# EAGLE design untitled (EAGLE 5.11)
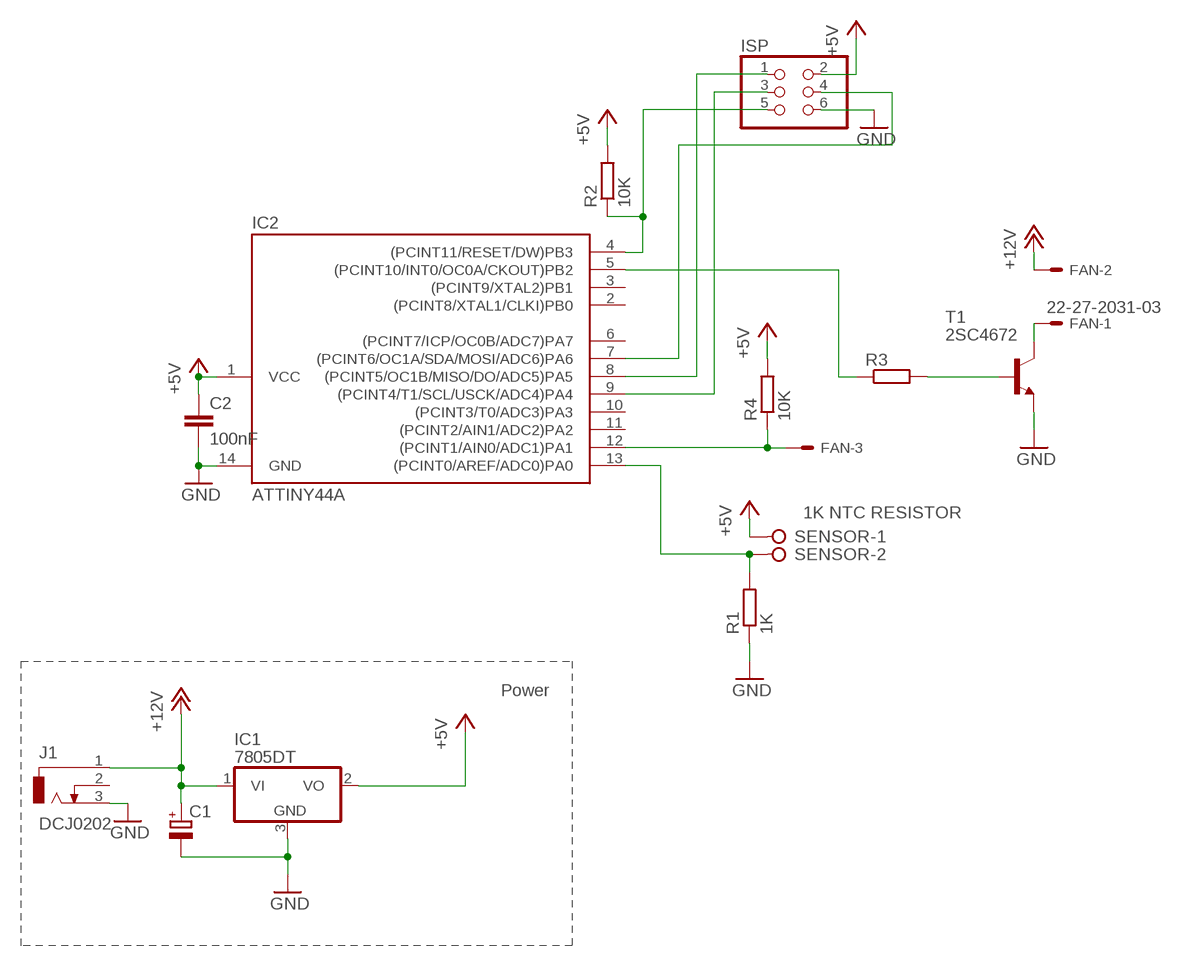
[diagram p0: schematic, sheet 1]

## Parts
C1  CPOL-EU  [NICHICON-18]
C2  100nF  C-EUC0805  [C0805]
FAN  22-27-2031-03  [6410-03]
IC1  7805DT  [TO252]
IC2  ATTINY44A  TINY24/44/84-SSU  [SOIC14]
ISP  PINHD-2X03_2.54-SMD  [2X03SMD]
J1  DCJ0202  [DCJ0202]
R1  1K  R-EU_R0805  [R0805]
R2  10K  R-EU_R0805  [R0805]
R3  R-EU_R0805  [R0805]
R4  10K  R-EU_R0805  [R0805]
SENSOR  W237-02P  [W237-132]
T1  2SC4672  -NPN-SOT89-BCE  [SOT89-BCE]

## Nets
+5V: C2.1 IC1.2(VO) IC2.1(VCC) ISP.2 R2.2 R4.2 SENSOR.1
+12V: C1.POS(+) FAN.2 IC1.1(VI) J1.1
GND: C1.NEG(-) C2.2 IC1.3(GND) IC2.14(GND) ISP.6 J1.3 R1.1 T1.E
N$1: IC2.13((PCINT0/AREF/ADC0)PA0) R1.2 SENSOR.2
N$2: IC2.4((PCINT11/RESET/DW)PB3) ISP.5 R2.1
N$3: IC2.8((PCINT5/OC1B/MISO/DO/ADC5)PA5) ISP.1
N$4: IC2.5((PCINT10/INT0/OC0A/CKOUT)PB2) R3.1
N$5: IC2.9((PCINT4/T1/SCL/USCK/ADC4)PA4) ISP.3
N$6: IC2.7((PCINT6/OC1A/SDA/MOSI/ADC6)PA6) ISP.4
N$7: R3.2 T1.B
N$8: FAN.3 IC2.12((PCINT1/AIN0/ADC1)PA1) R4.1
N$9: FAN.1 T1.C
Unconnected: IC2.2((PCINT8/XTAL1/CLKI)PB0) IC2.3((PCINT9/XTAL2)PB1) IC2.6((PCINT7/ICP/OC0B/ADC7)PA7) IC2.10((PCINT3/T0/ADC3)PA3) IC2.11((PCINT2/AIN1/ADC2)PA2) J1.2

## Notes on the sheet
- 1K NTC RESISTOR
- Power

## Library data of the parts
C1 = nichicon:CPOL-EU: POLARIZED CAPACITOR, European symbol
C2 = rcl:C-EU: CAPACITOR, European symbol
FAN = con-molex:22-?-03: CONNECTOR wire to board 2.54 mm (.1 inch) pitch header; OC_FARNELL: unknown; OC_NEWARK: unknown
IC1 = linear:78*: Positive VOLTAGE REGULATOR Source: http://cache.national.com/ds/LM/LM78L05.pdf http://www.fairchildsemi.com/ds/LM/LM7805.pdf
IC2 = avr-6:TINY24/44/84
ISP = pinhead-2:PINHD-2X03: PIN HEADER
J1 = con-jack:DCJ0202: DC POWER JACK Source: DCJ0202.pdf; OC_FARNELL: unknown; OC_NEWARK: unknown
R1-R4 = rcl:R-EU_: RESISTOR, European symbol
SENSOR = con-wago-508:W237-02P: WAGO SREW CLAMP; OC_FARNELL: unknown; OC_NEWARK: unknown
T1 = transistor:*-NPN-: NPN Transistror BF959 corrected 2008.03.06

## Board
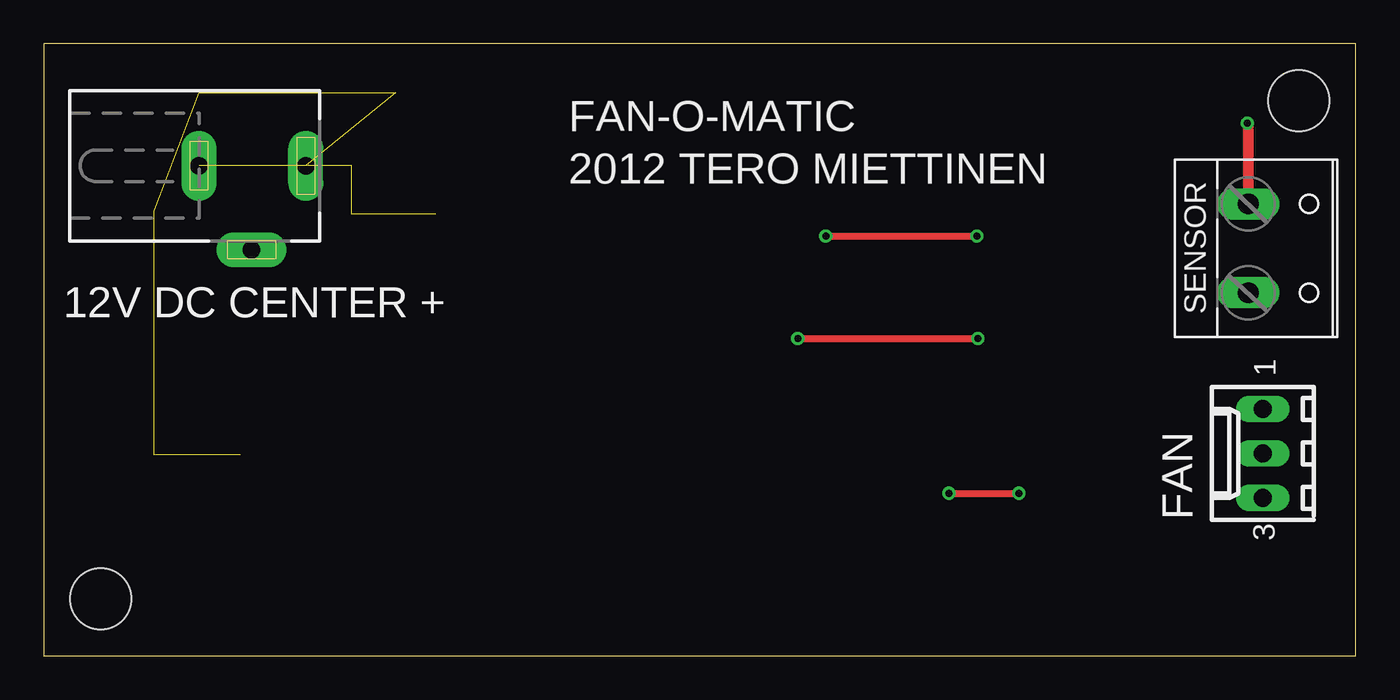
[diagram p1: board, top side]
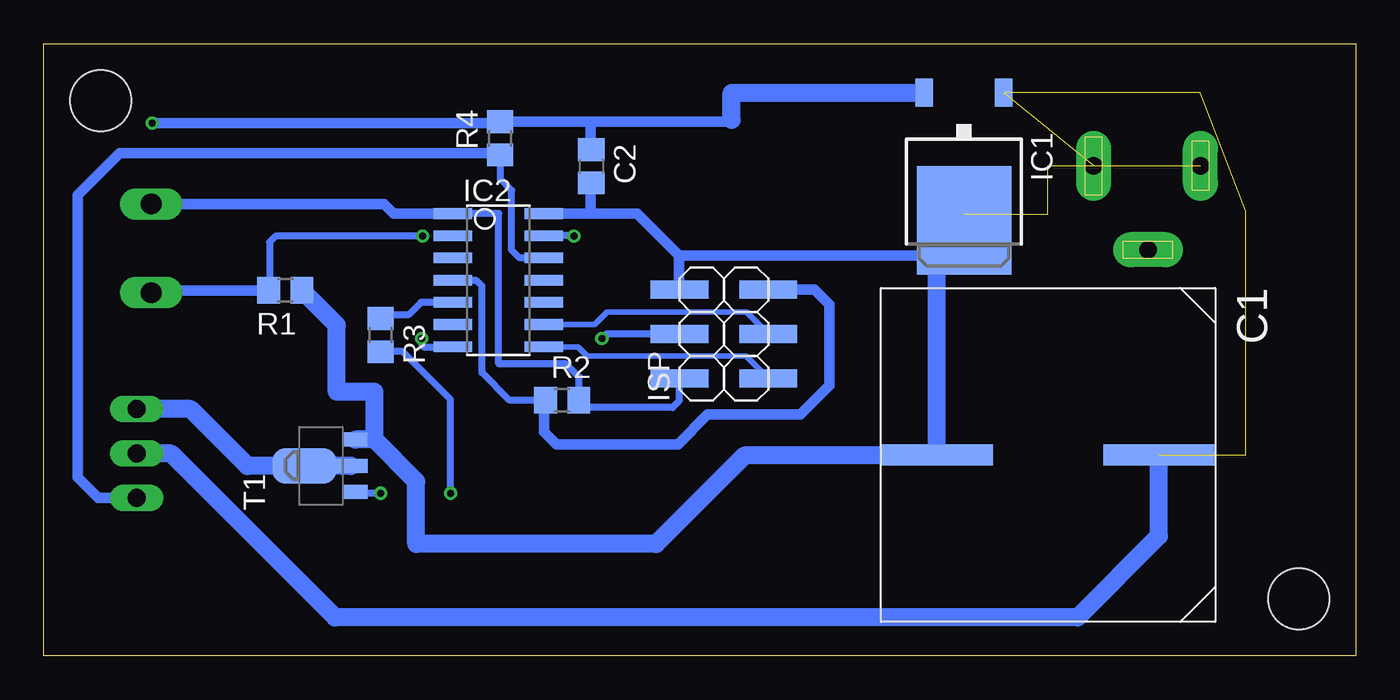
[diagram p2: board, bottom side, seen from below]

Size 75 x 35 mm. Coordinates in mm from the lower left corner, seen from the top.
Outline: 0,0 75,0 75,35 0,35 0,0
Copper layers (1*16): Top 0.0356mm / dielectric 1.5011mm / Bottom 0.0356mm
Design rules "LaenPCBOrder": minimum track width 6mil, minimum drill 13mil, track to track 6mil, track to pad 6mil, pad to pad 6mil, via to via 6mil, smd to smd 6mil, copper to edge 15mil, drill to drill 6mil, minimum pad ring 7mil, minimum via ring 7mil, stop-mask expansion 4mil, vias tented up to drill 0mil, thermal gap 10mil
Holes 3.5 mm at 3.25,3.25 71.75,31.75

### Footprints (pad centres in the part's own frame; a part is rotated, then mirrored left to right if it is on the bottom)
NICHICON-18 = smd 1.2 x 6.4: NEG 0,-6.35; POS 0,6.35
C0805 = smd 1.3 x 1.5: 1 -0.95,0; 2 0.95,0
6410-03 = drill 1.016 long: 1 2.54,0; 2 0,0; 3 -2.54,0
TO252 = smd 1 x 1.6: 1 -2.28,-4.8; 2 2.28,-4.8 | smd 5.4 x 6.2: 3 0,2.5
SOIC14 = smd 0.61 x 2.21: 1 -3.81,-2.603; 2 -2.54,-2.603; 3 -1.27,-2.603; 4 0,-2.603; 5 1.27,-2.603; 6 2.54,-2.603; 7 3.81,-2.603; 8 3.81,2.603; 9 2.54,2.603; 10 1.27,2.603; 11 0,2.603; 12 -1.27,2.603; 13 -2.54,2.603; 14 -3.81,2.603
2X03SMD = smd 1.016 x 3.302: 1 -1.27,-3.81; 2 -1.27,1.27; 3 1.27,-3.81; 4 1.27,1.27; 5 3.81,-3.81; 6 3.81,1.27
DCJ0202 = drill 1 pad 2 long: 1 0,3.1; 2 4.8,0; 3 0,-3
R0805 = smd 1.3 x 1.5: 1 -0.95,0; 2 0.95,0
W237-132 = drill 1.194 long: 1 -2.54,-0.635; 2 2.54,-0.635
SOT89-BCE = smd 0.8 x 1.4: B -1.499,-1.981; E 1.499,-1.981 | smd 0.8 x 1.9: C 0,-1.727 | smd 2.032 x 3.65: C@1 0,0.94

### Placement (x,y rotation side)
C1  17.59,11.49 270 bottom
C2  43.7,28 270 bottom
FAN  69.69,11.57 90 top
IC1  22.4,27.39 180 bottom
IC2  49.02,21.48 270 bottom
ISP  37.39,17.13 90 bottom
J1  11.88,28.02 270 top
R1  61.19,20.9 180 bottom
R2  45.37,14.61 0 bottom
R3  55.74,18.34 270 bottom
R4  48.91,29.59 90 bottom
SENSOR  69.49,23.3 270 top
T1  59.16,10.86 90 bottom

### Tracks (layer width: path | path; a pad name or v marks a point on that pad's centre or on a via)
+5V  (via drill 0.4)
  Top 0.61: v68.8,30.45 68.86,30.39 SENSOR.1
  Bottom 0.406: IC2.1 49,25.29 49,16.7 45.15,16.7 44.4,15.95 44.4,14.63 R2.2 44.01,14.2 39.05,14.2 38.66,14.59 ISP.2
  Bottom 0.61: 43.75,30.54 R4.2 49,30.45 v68.8,30.45 | 43.75,30.54 35.68,30.54 35.68,30.65 | SENSOR.1 55.54,25.84 54.99,25.29 IC2.1 | C2.1 43.75,29 43.75,30.54
  Bottom 1.016: IC1.2 35.68,32.19 35.68,30.65
+12V  (5 unrouted)
  Bottom 1.016: C1.POS 11.25,6.85 15.9,2.2 58.35,2.2 67.72,11.57 FAN.2
GND  (3 unrouted)
  Bottom 0.61: 24.39,22.9 38.7,22.9 | 38.7,22.9 38.7,20.98 ISP.6 | 43.75,25.29 41.09,25.29 38.7,22.9 | 43.75,25.29 IC2.14 | C2.2 43.75,27 43.75,25.29
  Bottom 1.016: IC1.3 22.4,25.25 | IC1.3 23.94,24.89 C1.NEG 23.98,11.45 34.95,11.45 40,6.4 53.7,6.4 53.7,9.96 56.1,12.36 | 56.1,12.36 T1.E | R1.1 58.25,18.91 58.25,15.1 56.1,15.1 56.1,12.36 | IC1.3 24.39,22.9
N$1  (via drill 0.4)
  Top 0.406: v44.7,24 v53.35,24
  Bottom 0.406: IC2.13 44.9,24.02 v44.7,24 | v53.35,24 61.75,24 62.1,23.65 62.1,20.94 R1.2
  Bottom 0.61: SENSOR.2 68.72,20.9 R1.2
N$2
  Bottom 0.406: R2.1 48.36,14.61 49.95,16.2 49.95,21.15 50.25,21.45 51.59,21.45 IC2.4
  Bottom 0.61: ISP.5 30.94,20.94 30.1,20.1 30.1,15.45 31.75,13.8 37.05,13.8 38.75,12.1 45.7,12.1 46.4,12.8 46.4,14.53 R2.1
N$3
  Bottom 0.305: ISP.1 34.87,17.15 43.95,17.15 44.47,17.67 IC2.8
N$4
  Bottom 0.406: IC2.5 53.44,20.21 54.15,19.5 55.53,19.5 R3.1
N$5
  Bottom 0.305: ISP.3 34.83,19.65 42.8,19.65 43.51,18.94 IC2.9
N$6  (via drill 0.4)
  Top 0.406: v43.1,18.15 v53.4,18.15
  Bottom 0.406: ISP.4 42.85,18.4 v43.1,18.15 | v53.4,18.15 53.4,17.8 53.25,17.65 51.64,17.65 IC2.7
N$7  (via drill 0.4)
  Top 0.406: v51.75,9.3 v55.75,9.3
  Bottom 0.406: R3.2 54.49,17.39 51.75,14.65 v51.75,9.3 | v55.75,9.3 57.12,9.3 T1.B
N$8
  Bottom 0.406: IC2.12 47.8,22.75 48.25,23.2 48.25,26.6 48.9,27.25 R4.1
  Bottom 0.61: FAN.3 71.88,9.03 73.05,10.2 73.05,26.35 70.65,28.75 49.02,28.75 R4.1
N$9
  Bottom 1.016: FAN.1 66.61,14.11 63.35,10.85 57.44,10.85 T1.C

### Text on the board
tPlace: FAN-O-MATIC | 2012 TERO MIETTINEN | 12V DC CENTER +
tValues: SENSOR